# Altium schematic sheet Dynamixel.SchDoc
size A; SheetNumber: 6; SheetTotal: 6
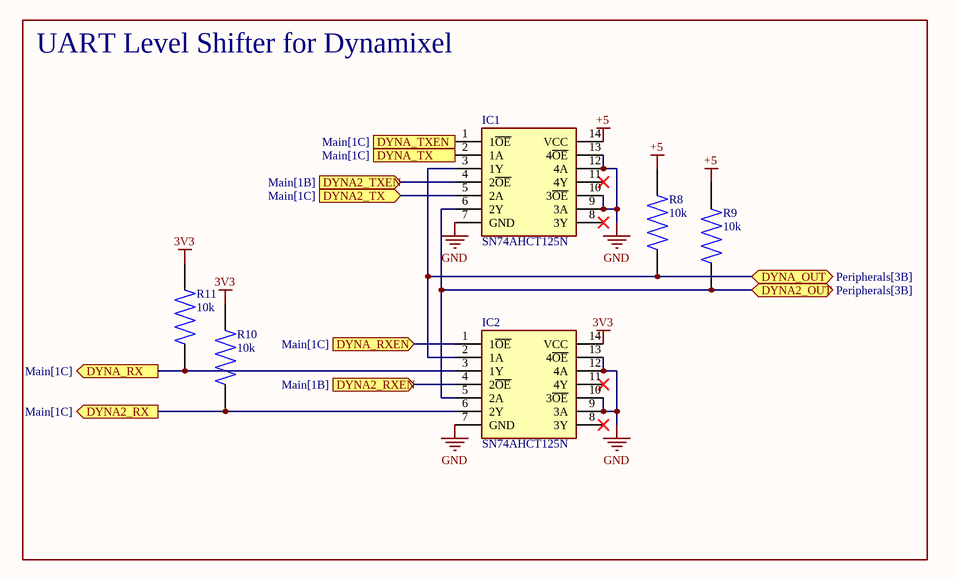
[diagram p0: Dynamixel.SchDoc]

## Parts
IC1  SN74AHCT125N  [DIP794W53P254L1930H508Q14N]
IC2  SN74AHCT125N  [DIP794W53P254L1930H508Q14N]
R8  10k  [RESC2012X55N]
R9  10k  [RESC2012X55N]
R10  10k  [RESC2012X55N]
R11  10k  [RESC2012X55N]

## Blocks framed on the sheet
UART Level Shifter for Dynamixel: IC1 IC2 R8-R11

## Ports
DYNA2_OUT (bidir, see Peripherals[3B]), DYNA2_RX (out, see Main[1C]), DYNA2_RXEN (in, see Main[1B]), DYNA2_TX (in, see Main[1C]), DYNA2_TXEN (in, see Main[1B]), DYNA_OUT (bidir, see Peripherals[3B]), DYNA_RX (out, see Main[1C]), DYNA_RXEN (in, see Main[1C]), DYNA_TX (in, see Main[1C]), DYNA_TXEN (in, see Main[1C])

## Nets
3V3: IC2.14(VCC) R10.2 R11.2
+5: IC1.14(VCC) R8.2 R9.2
GND: IC1.7(GND) IC1.9(3A) IC1.10(3~{OE}) IC1.12(4A) IC1.13(4~{OE}) IC2.7(GND) IC2.9(3A) IC2.10(3~{OE}) IC2.12(4A) IC2.13(4~{OE})
DYNA2_OUT: IC1.6(2Y) IC2.5(2A) R9.1 ; port DYNA2_OUT
DYNA2_RX: IC2.6(2Y) R10.1 ; port DYNA2_RX
DYNA2_RXEN: IC2.4(2~{OE}) ; port DYNA2_RXEN
DYNA2_TX: IC1.5(2A) ; port DYNA2_TX
DYNA2_TXEN: IC1.4(2~{OE}) ; port DYNA2_TXEN
DYNA_OUT: IC1.3(1Y) IC2.2(1A) R8.1 ; port DYNA_OUT
DYNA_RX: IC2.3(1Y) R11.1 ; port DYNA_RX
DYNA_RXEN: IC2.1(1~{OE}) ; port DYNA_RXEN
DYNA_TX: IC1.2(1A) ; port DYNA_TX
DYNA_TXEN: IC1.1(1~{OE}) ; port DYNA_TXEN

Not connected (* = marked no-connect by the designer): IC1 8(3Y)* 11(4Y)*; IC2 8(3Y)* 11(4Y)*

## Library data of the parts
IC1 IC2 = SN74AHCT125N: Integrated Circuit; Manufacturer_Name: Texas Instruments; Datasheet Link: http://www.ti.com/lit/gpn/sn74ahct125; Height: 5.08mm; Manufacturer_Part_Number: SN74AHCT125N; Mouser Part Number: 595-SN74AHCT125N; Mouser Price/Stock: https://www.mouser.co.uk/ProductDetail/Texas-Instruments/SN74AHCT125N?qs=1wQRf3HkBjyxwrHMwAiMfw%3D%3D; Arrow Part Number: SN74AHCT125N; Arrow Price/Stock: https://www.arrow.com/en/products/sn74ahct125n/texas-instruments?region=nac
R8-R11 = TNPW0805270RBETA: MF: {'manufacturer': u'Vishay'}; MP: TNPW0805270RBETA; Availability: Unavailable; Package: None; Value: *; Price: None